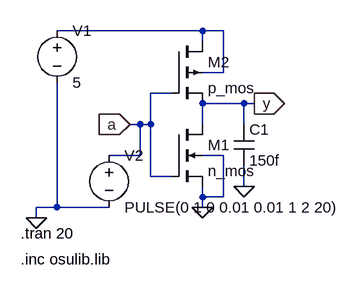
[diagram p0: schematic mos_inverter.asc]
mos_inverter.asc, the LTspice schematic file:
Version 4
SHEET 1 880 680
WIRE 160 32 -64 32
WIRE 192 32 160 32
WIRE 160 48 160 32
WIRE 192 96 192 32
WIRE 192 96 160 96
WIRE 112 128 80 128
WIRE 224 144 160 144
WIRE 240 144 224 144
WIRE 64 176 48 176
WIRE 80 176 80 128
WIRE 80 176 64 176
WIRE 160 176 160 144
WIRE 224 176 224 144
WIRE 64 224 64 176
WIRE 64 224 16 224
WIRE 192 224 160 224
WIRE 80 256 80 176
WIRE 112 256 80 256
WIRE 224 272 224 240
WIRE 160 288 160 272
WIRE 192 288 192 224
WIRE 192 288 160 288
WIRE -64 304 -64 112
WIRE -64 304 -96 304
WIRE 16 304 -64 304
WIRE 160 304 160 288
WIRE -96 320 -96 304
FLAG 160 304 0
FLAG 48 176 a
IOPIN 48 176 In
FLAG 240 144 y
IOPIN 240 144 Out
FLAG -96 320 0
FLAG 224 272 0
SYMBOL nmos4 112 176 R0
SYMATTR InstName M1
SYMATTR Value n_mos
SYMBOL pmos4 112 48 R0
SYMATTR InstName M2
SYMATTR Value p_mos
SYMBOL voltage -64 16 R0
WINDOW 123 0 0 Left 0
WINDOW 39 0 0 Left 0
SYMATTR InstName V1
SYMATTR Value 5
SYMBOL voltage 16 208 R0
WINDOW 123 0 0 Left 0
WINDOW 39 0 0 Left 0
SYMATTR InstName V2
SYMATTR Value PULSE(0 1 0 0.01 0.01 1 2 20)
SYMBOL cap 208 176 R0
SYMATTR InstName C1
SYMATTR Value 150f
TEXT -120 344 Left 2 !.tran 20
TEXT -120 384 Left 2 !.inc osulib.lib

The netlist it stands for:
* mos_inverter.asc
M1 y a 0 0 n_mos
M2 N001 a y N001 p_mos
V1 N001 0 5
V2 a 0 PULSE(0 1 0 0.01 0.01 1 2 20)
C1 y 0 150f
.model NMOS NMOS
.model PMOS PMOS
.lib standard.mos
.tran 20
.inc osulib.lib
.backanno
.end